# EAGLE design AutomatonXL320 (EAGLE 9.6.2)
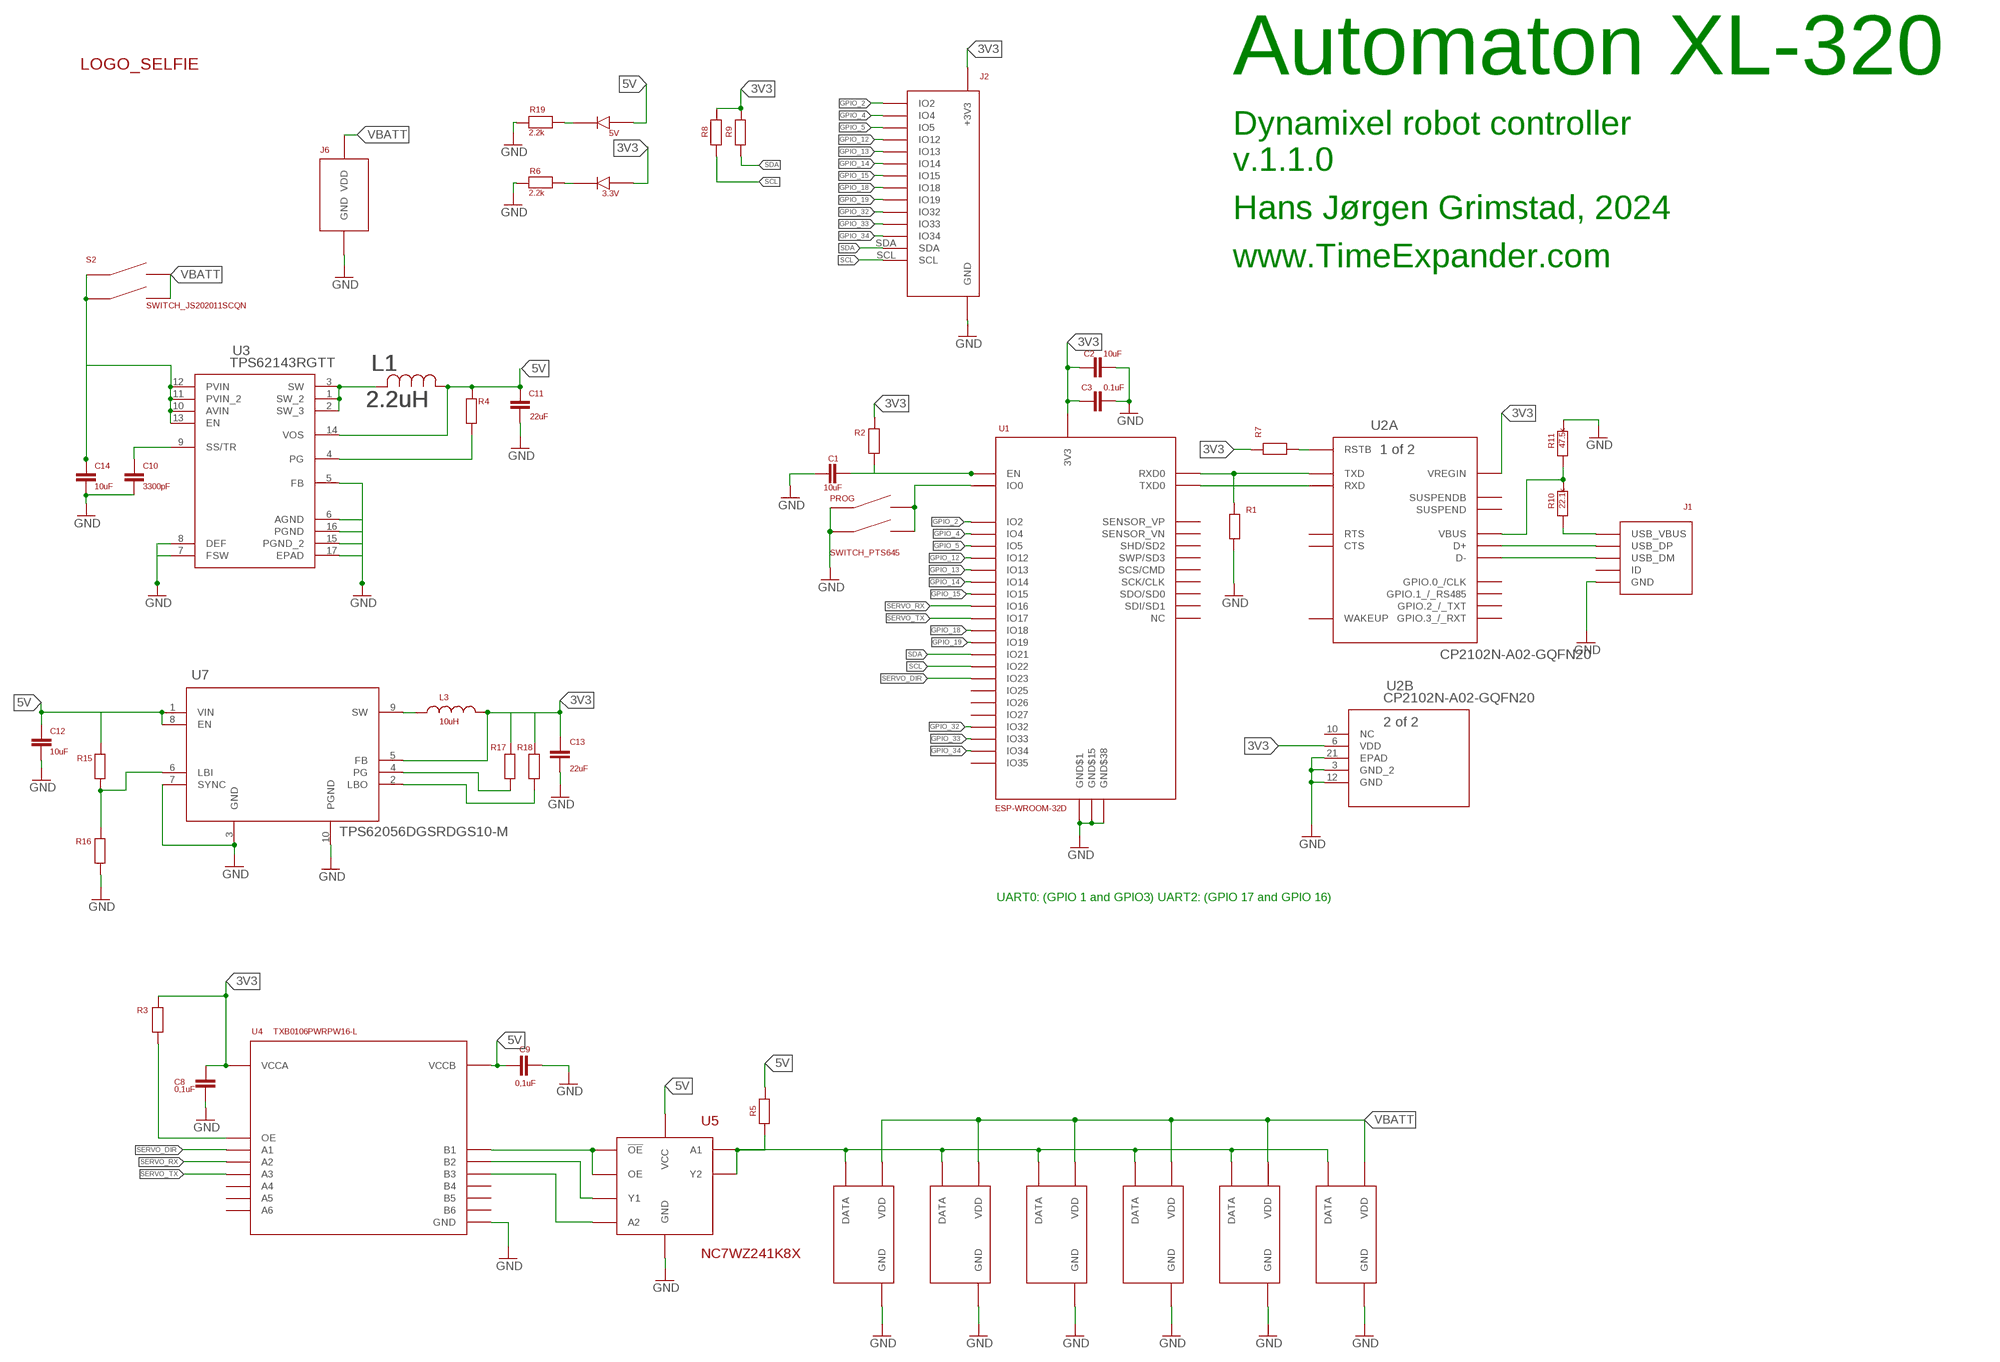
[diagram p0: schematic, sheet 1]

## Parts
3.3V  LED_APTR3216PBC/A  [LED_APTR3216PBC/A]
5V  LED_APTR3216PBC/A  [LED_APTR3216PBC/A]
C1  10uF  CAPACITOR0402  [CAP_0402]
C2  10uF  CAPACITOR0402  [CAP_0402]
C3  0.1uF  CAPACITOR0402  [CAP_0402]
C8  0,1uF  CAPACITOR0402  [CAP_0402]
C9  0,1uF  CAPACITOR0402  [CAP_0402]
C10  3300pF  CAPACITOR0402  [CAP_0402]
C11  22uF  CAPACITOR1206  [CAP_1206]
C12  10uF  CAPACITOR1206  [CAP_1206]
C13  22uF  CAPACITOR1206  [CAP_1206]
C14  10uF  CAPACITOR1206  [CAP_1206]
J1  USB_RCPT_10118192-0001LF  [USB_RCPT_10118192-0001LF]
J2  ESP_ROBOT_BOARD_GPIO_16  [ESP_ROBOT_BOARD_GPIO_16]
J6  BATTERY  POWER_SOLDER_TERMINAL9V  [BATTERY_SOLDER_TERMINAL]
L1  2.2uH  IHLP1616ABER2R2M11IND_IHLP-1616AB-M  [IND_IHLP-1616AB-M]
L3  10uH  INDUCTOR_VLCF4024T-100MR90-2  [IND_4028]
PROG  SWITCH_PTS645  [SWITCH_PTS645_EE_NBIOT_01]
R1  RESISTOR0402  [RES_0402]
R2  RESISTOR0402  [RES_0402]
R3  RESISTOR0402  [RES_0402]
R4  RESISTOR0402  [RES_0402]
R5  RESISTOR0402  [RES_0402]
R6  2.2k  RESISTOR  [RES_0402]
R7  RESISTOR0402  [RES_0402]
R8  RESISTOR0402  [RES_0402]
R9  RESISTOR0402  [RES_0402]
R10  22.1k  RESISTOR0402  [RES_0402]
R11  47.5k  RESISTOR0402  [RES_0402]
R15  RESISTOR0402  [RES_0402]
R16  RESISTOR0402  [RES_0402]
R17  RESISTOR0402  [RES_0402]
R18  RESISTOR0402  [RES_0402]
R19  2.2k  RESISTOR  [RES_0402]
S2  SWITCH_JS202011SCQN  [SWITCH_JS202011SCQN]
U1  ESP-WROOM-32D  [ESP_WROOM_32D]
U2  CP2102N-A02-GQFN20  [QFN20_CP2102N_SIL]
U3  TPS62143RGTT  [RGT16_1P7X1P7]
U4  TXB0106PWRPW16-L  [PW16-L]
U5  NC7WZ241K8X  [NC7WZ241K8X]
U7  TPS62056DGSRDGS10-M  [DGS10-M]
U$1  DYNAMIXEL_MOLEX_MINISPOX_3P_HEADERXL-320  [DYNAMIXEL_MICROLATCH_3P_HEADER]
U$2  LOGO_SELFIESELFIE_2  [TIMEEXPANDER_LOGO_1]
U$4  DYNAMIXEL_MOLEX_MINISPOX_3P_HEADERXL-320  [DYNAMIXEL_MICROLATCH_3P_HEADER]
U$5  DYNAMIXEL_MOLEX_MINISPOX_3P_HEADERXL-320  [DYNAMIXEL_MICROLATCH_3P_HEADER]
U$6  DYNAMIXEL_MOLEX_MINISPOX_3P_HEADERXL-320  [DYNAMIXEL_MICROLATCH_3P_HEADER]
U$8  DYNAMIXEL_MOLEX_MINISPOX_3P_HEADERXL-320  [DYNAMIXEL_MICROLATCH_3P_HEADER]
U$9  DYNAMIXEL_MOLEX_MINISPOX_3P_HEADERXL-320  [DYNAMIXEL_MICROLATCH_3P_HEADER]

## Nets
3V3: 3.3V.A C2.P$1 C3.P$1 C8.P$2 C13.P$1 J2.+3V3 L3.2 R2.P$2 R3.P$2 R7.P$1 R8.P$2 R9.P$2 R17.P$2 R18.P$2 U1.2(3V3) U2.6(B:VDD) U2.7(A:VREGIN) U4.2(VCCA) U7.5(FB)
5V: 5V.A C9.P$1 C11.P$1 C12.P$1 L1.1 R4.P$2 R5.P$2 R15.P$2 U3.14(VOS) U4.15(VCCB) U5.VCC U7.1(VIN) U7.8(EN)
GND: C1.P$1 C2.P$2 C3.P$2 C8.P$1 C9.P$2 C10.P$2 C11.P$2 C12.P$2 C13.P$2 C14.P$2 J1.GND J2.GND J6.-(GND) PROG.A1 PROG.A2 R1.P$2 R6.P$1 R11.P$2 R16.P$1 R19.P$1 U1.1(GND$1) U1.15(GND$15) U1.38(GND$38) U1.GND$39(GND$38) U1.GND$40(GND$38) U1.GND$41(GND$38) U1.GND$42(GND$38) U1.GND$43(GND$38) U1.GND$44(GND$38) U1.GND$45(GND$38) U1.GND$46(GND$38) U1.GND$47(GND$38) U2.3(B:GND_2) U2.12(B:GND) U2.21(B:EPAD) U3.5(FB) U3.6(AGND) U3.7(FSW) U3.8(DEF) U3.15(PGND_2) U3.16(PGND) U3.17(EPAD) U4.9(GND) U5.GND U7.3(GND) U7.7(SYNC) U7.10(PGND) U$1.GND U$4.GND U$5.GND U$6.GND U$8.GND U$9.GND
GPIO_2: J2.IO2 U1.24(IO2)
GPIO_4: J2.IO4 U1.26(IO4)
GPIO_5: J2.IO5 U1.29(IO5)
GPIO_12: J2.IO12 U1.14(IO12)
GPIO_13: J2.IO13 U1.16(IO13)
GPIO_14: J2.IO14 U1.13(IO14)
GPIO_15: J2.IO15 U1.23(IO15)
GPIO_18: J2.IO18 U1.30(IO18)
GPIO_19: J2.IO19 U1.31(IO19)
GPIO_32: J2.IO32 U1.8(IO32)
GPIO_33: J2.IO33 U1.9(IO33)
GPIO_34: J2.IO34 U1.6(IO34)
N$1: C1.P$2 R2.P$1 U1.3(EN)
N$2: 3.3V.C R6.P$2
N$3: C10.P$1 U3.9(SS/TR)
N$4: R1.P$1 U1.34(RXD0) U2.18(A:TXD)
N$5: U1.35(TXD0) U2.17(A:RXD)
N$6: PROG.B1 PROG.B2 U1.25(IO0)
N$7: L1.2 U3.1(SW_2) U3.2(SW_3) U3.3(SW)
N$8: U4.16(B1) U5.!OE U5.OE
N$9: R4.P$1 U3.4(PG)
N$10: U4.14(B2) U5.Y1
N$11: U4.13(B3) U5.A2
N$12: R7.P$2 U2.9(A:RSTB)
N$13: C14.P$1 S2.2(A2) S2.5(A1) U3.10(AVIN) U3.11(PVIN_2) U3.12(PVIN) U3.13(EN)
N$14: R3.P$1 U4.8(OE)
N$15: J1.VCC(USB_VBUS) R10.P$1
N$16: J1.D+(USB_DP) U2.4(A:D+)
N$17: J1.D-(USB_DM) U2.5(A:D-)
N$18: R10.P$2 R11.P$1 U2.8(A:VBUS)
N$19: R5.P$1 U5.A1 U5.Y2 U$1.DATA U$4.DATA U$5.DATA U$6.DATA U$8.DATA U$9.DATA
N$23: 5V.C R19.P$2
N$77: R15.P$1 R16.P$2 U7.6(LBI)
N$78: L3.1 U7.9(SW)
N$80: R17.P$1 U7.4(PG)
N$81: R18.P$1 U7.2(LBO)
SCL: J2.SCL R8.P$1 U1.36(IO22)
SDA: J2.SDA R9.P$1 U1.33(IO21)
SERVO_DIR: U1.37(IO23) U4.1(A1)
SERVO_RX: U1.27(IO16) U4.3(A2)
SERVO_TX: U1.28(IO17) U4.4(A3)
VBATT: J6.+(VDD) S2.3(B2) S2.6(B1) U$1.VDD U$4.VDD U$5.VDD U$6.VDD U$8.VDD U$9.VDD
Unconnected: J1.ID U1.4(SENSOR_VP) U1.5(SENSOR_VN) U1.7(IO35) U1.10(IO25) U1.11(IO26) U1.12(IO27) U1.17(SHD/SD2) U1.18(SWP/SD3) U1.19(SCS/CMD) U1.20(SCK/CLK) U1.21(SDO/SD0) U1.22(SDI/SD1) U1.32(NC) U2.1(A:GPIO.1_/_RS485) U2.2(A:GPIO.0_/CLK) U2.10(B:NC) U2.11(A:SUSPENDB) U2.13(A:WAKEUP) U2.14(A:SUSPEND) U2.15(A:CTS) U2.16(A:RTS) U2.19(A:GPIO.3_/_RXT) U2.20(A:GPIO.2_/_TXT) U4.5(A4) U4.6(A5) U4.7(A6) U4.10(B6) U4.11(B5) U4.12(B4)

## Notes on the sheet
- Automaton XL-320
- Dynamixel robot controller
- v.1.1.0
- Hans Jørgen Grimstad, 2024
- www.TimeExpander.com
- UART0: (GPIO 1 and GPIO3) UART2: (GPIO 17 and GPIO 16)

## Library data of the parts
3.3V 5V = TimeExpander2:LED_APTR3216PBC/A
C1-C3 C8-C14 = TimeExpander2:CAPACITOR
J1 = TimeExpander2:USB_RCPT_10118192-0001LF
J2 = TimeExpander2:ESP_ROBOT_BOARD_GPIO_16
J6 = TimeExpander2:POWER_SOLDER_TERMINAL
L1 = TimeExpander2:IHLP1616ABER2R2M11; BUILT_BY: EMA_UL_Team; MANUFACTURER_PART_NUMBER: IHLP1616ABER2R2M11; VENDOR: VISHAY
L3 = TimeExpander2:INDUCTOR_VLCF4024T-100MR90-2
PROG = TimeExpander2:SWITCH_PTS645
R1-R11 R15-R19 = TimeExpander2:RESISTOR
S2 = TimeExpander2:SWITCH_JS202011SCQN
U1 = TimeExpander2:ESP-WROOM-32D
U2 = TimeExpander2:CP2102N-A02-GQFN20; COPYRIGHT: Copyright (C) 2023 Ultra Librarian. All rights reserved.; MANUFACTURER_PART_NUMBER: CP2102N-A02-GQFN20; MFR_NAME: Silicon Labs
U3 = TimeExpander2:TPS62143RGTT; BUILT_BY: EMA_UL_Team; MANUFACTURER: Texas Instruments; MANUFACTURER_PART_NUMBER: TPS62143RGTT; VENDOR: Texas Instruments
U4 = TimeExpander2:TXB0106PWR; MANUFACTURER_PART_NUMBER: TXB0106PWR; VENDOR: Texas Instruments
U5 = TimeExpander2:NC7WZ241K8X
U7 = TimeExpander2:TPS62056DGSR; BUILT_BY: EMA_UL_Team; MANUFACTURER: Texas Instruments; MANUFACTURER_PART_NUMBER: TPS62056DGSR; VENDOR: Texas Instruments
U$1 U$4-U$6 U$8 U$9 = TimeExpander2:DYNAMIXEL_MOLEX_MINISPOX_3P_HEADER
U$2 = TimeExpander2:LOGO_SELFIE

## Board
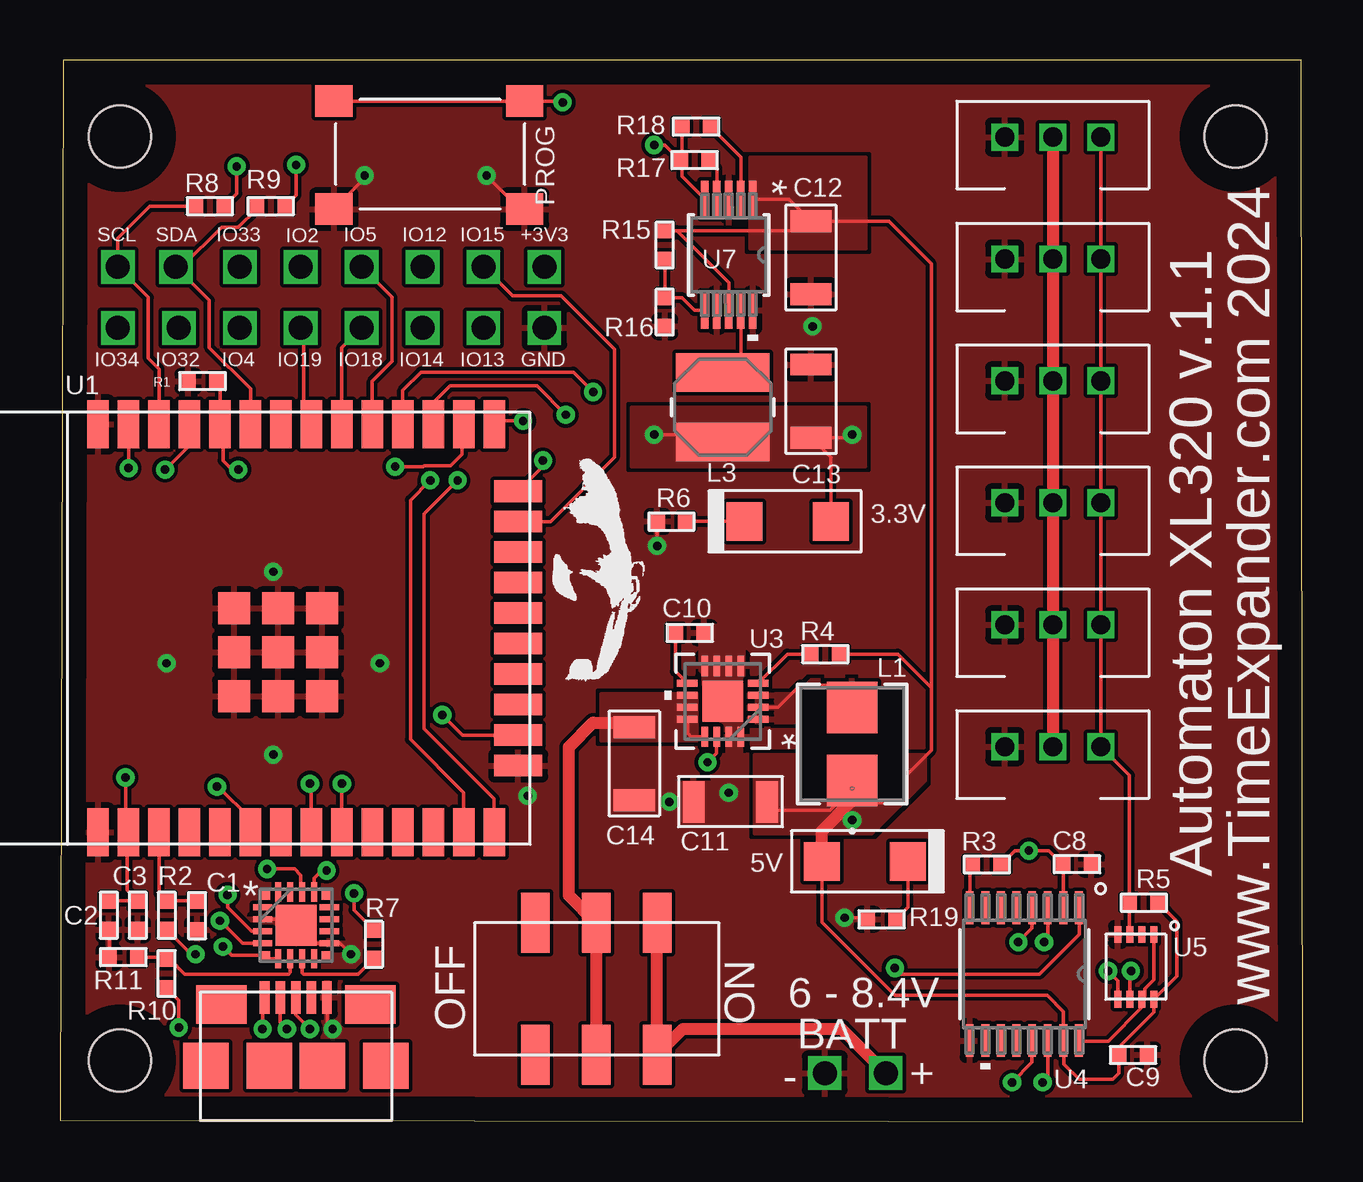
[diagram p1: board, top side]
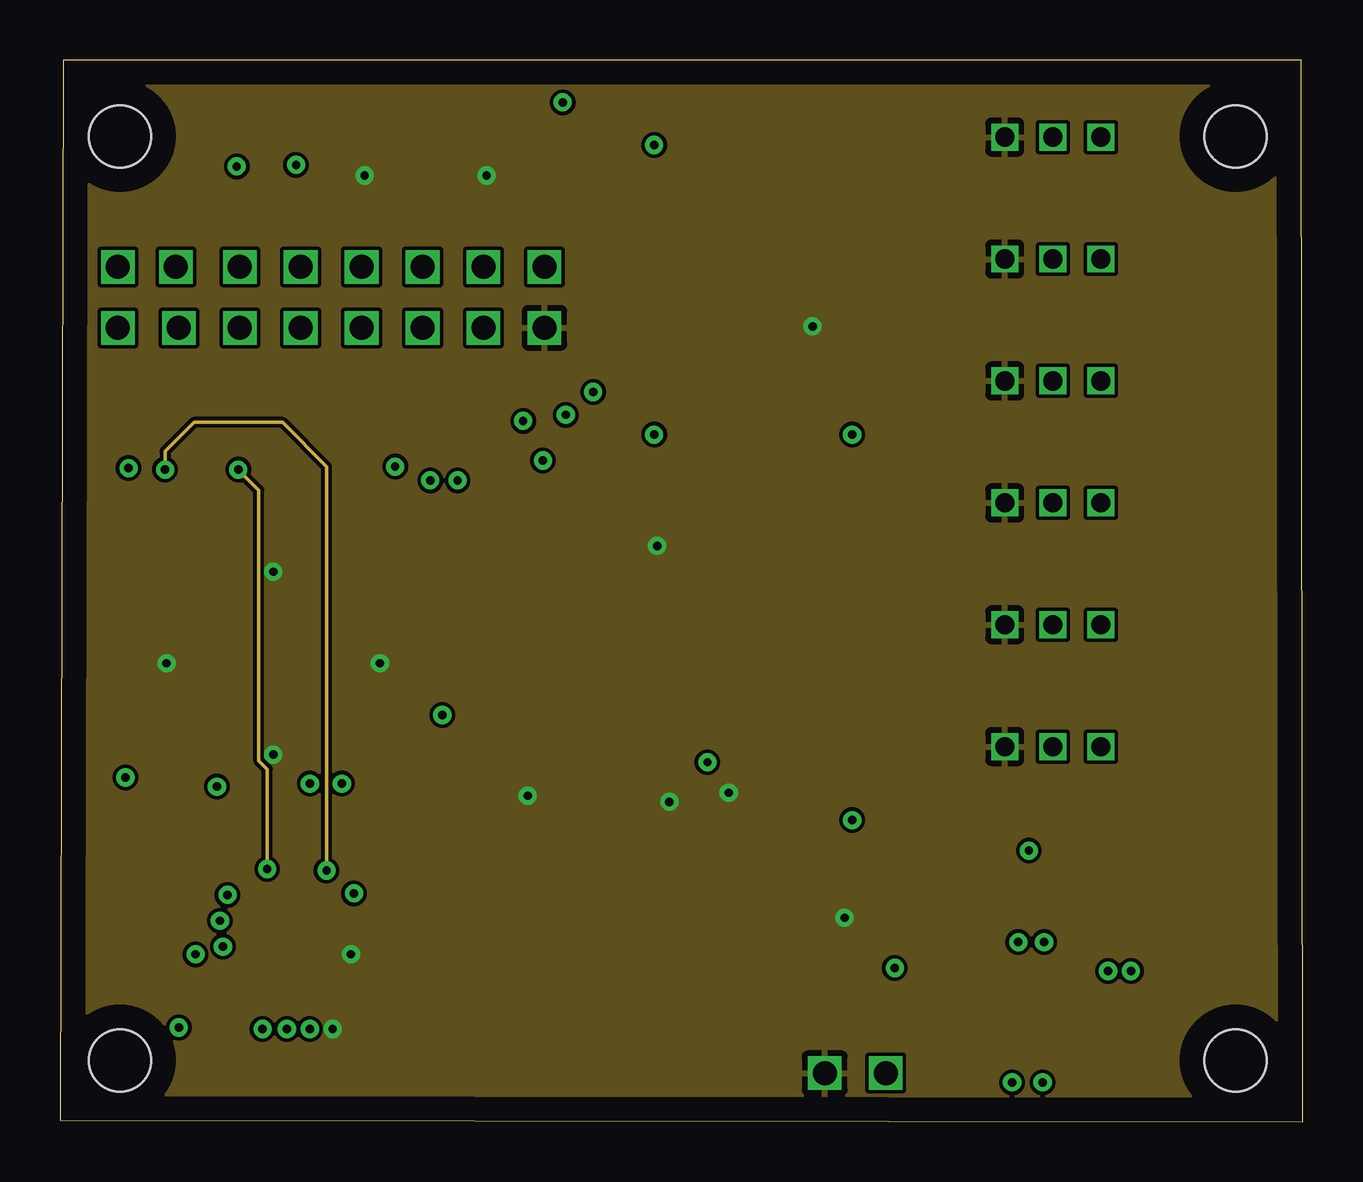
[diagram p2: board, inner layer GND]
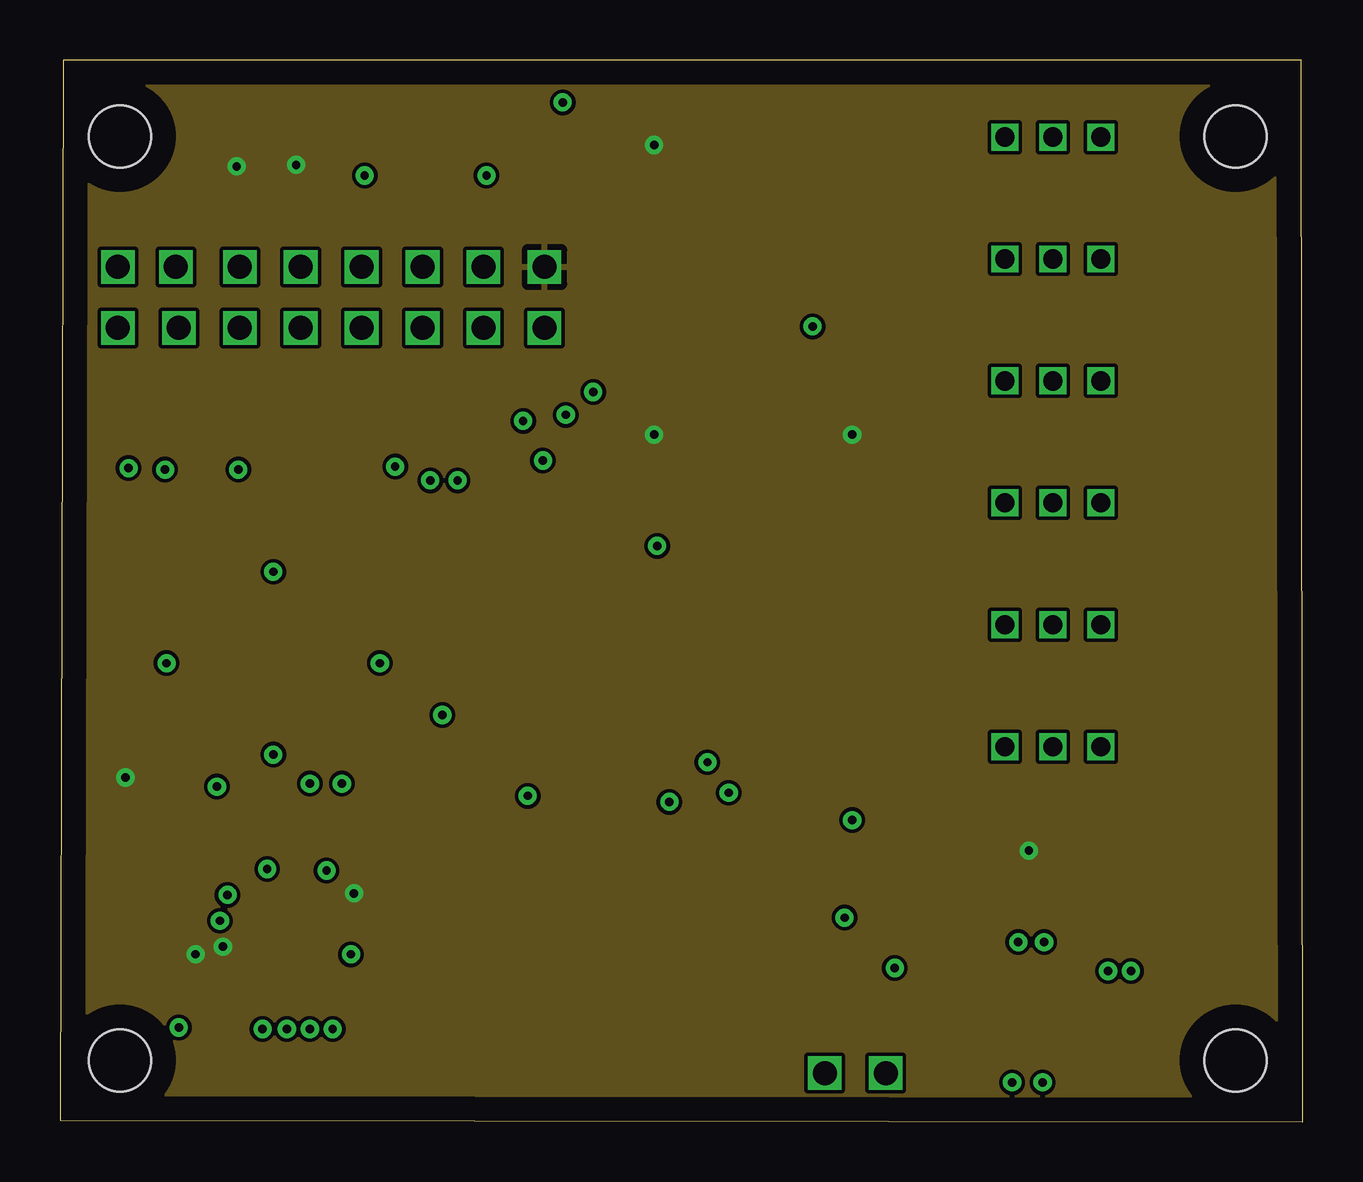
[diagram p3: board, inner layer 3V3]
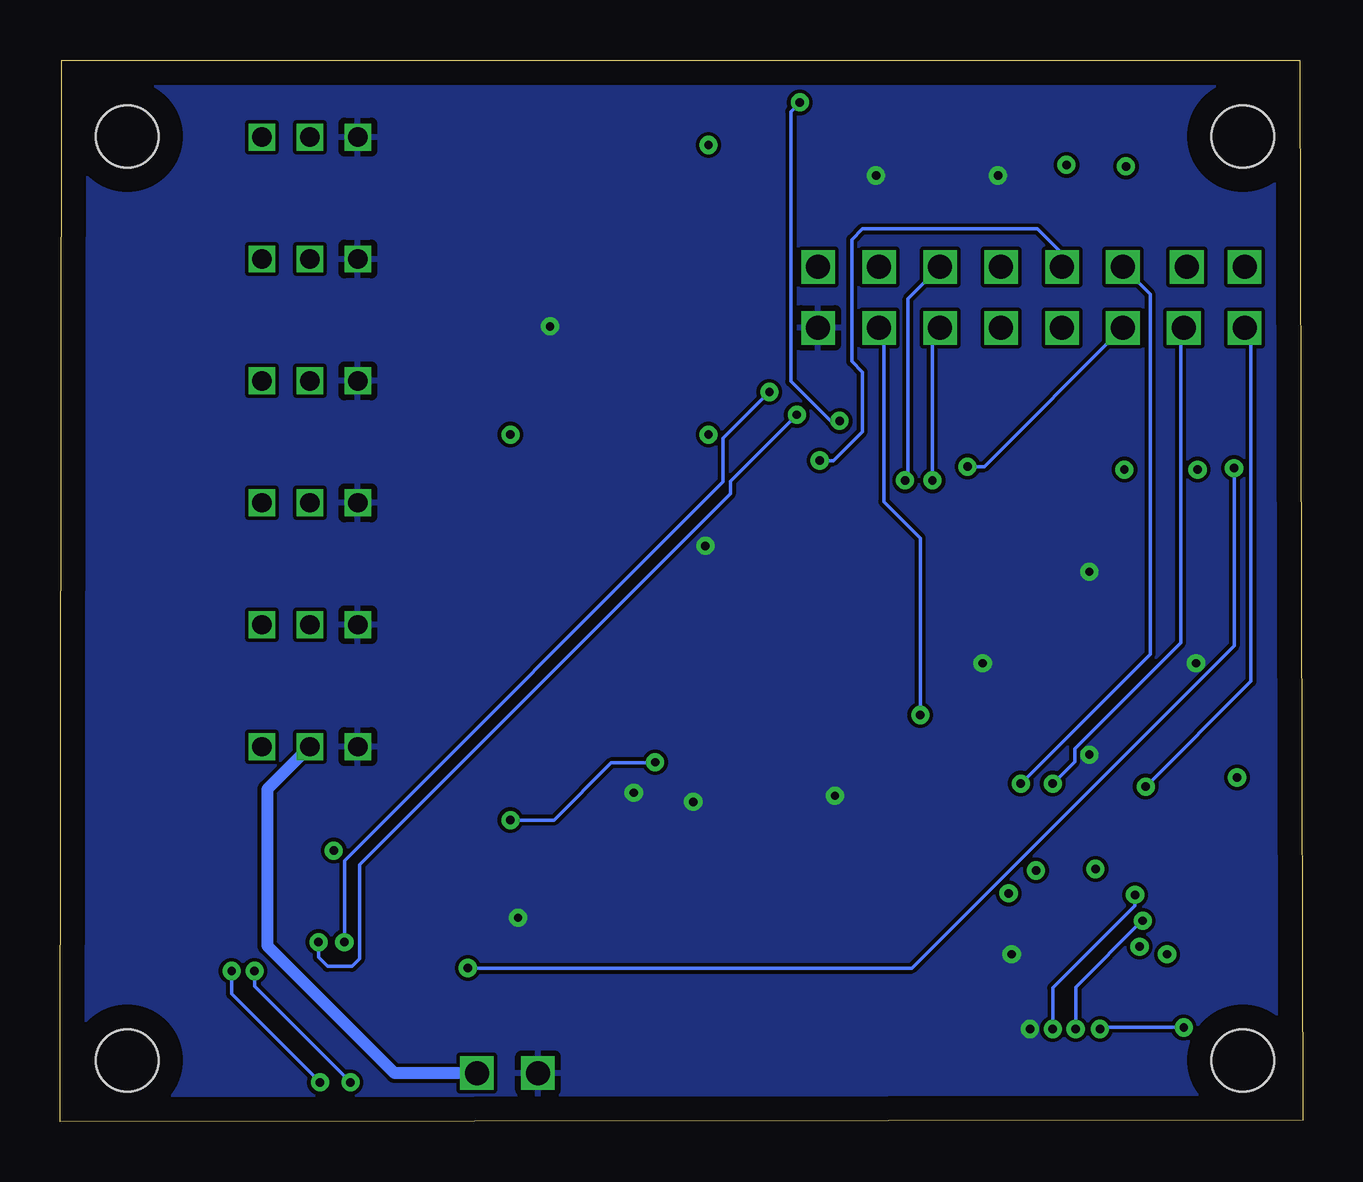
[diagram p4: board, bottom side, seen from below]

Size 51.8 x 44.25 mm. Coordinates in mm from the lower left corner, seen from the top.
Outline: 0,0.06 51.8,0 51.73,44.25 0.13,44.25 0,0.06
Copper layers (1+2*15+16): Top 0.035mm / dielectric 1.5mm / GND 0.035mm / dielectric 0.15mm / 3V3 0.035mm / dielectric 0.2mm / Bottom 0.035mm
Design rules "default *": minimum track width 6mil, minimum drill 0.35mm, track to track 6mil, track to pad 6mil, pad to pad 6mil, via to via 6mil, smd to smd 6mil, copper to edge 40mil, drill to drill 6mil, minimum pad ring 5mil, minimum via ring 8mil, stop-mask expansion 4mil, vias tented up to drill 14mil, thermal gap 10mil
Holes 2.6 mm at 2.5,41.06 49,2.56 2.5,2.56 49,41.06

### Footprints (pad centres in the part's own frame; a part is rotated, then mirrored left to right if it is on the bottom)
LED_APTR3216PBC/A = smd 1.5 x 1.6: A 0,0; C 3.6,0
CAP_0402 = smd 0.635 x 0.61: P$1 0,0; P$2 1.194,0
CAP_1206 = smd 0.914 x 1.72: P$1 0,0; P$2 3.048,0
USB_RCPT_10118192-0001LF = smd 0.4 x 1.35: D+ 3.1,0.3; D- 2.45,0.3; GND 4.4,0.3; ID 3.75,0.3; VCC 1.8,0.3 | smd 2.1 x 1.6: P$1 0,0; P$2 6.2,0 | smd 1.9 x 1.9: P$8 -0.65,-2.55; P$9 6.85,-2.55; P$10 2,-2.55; P$11 4.2,-2.55
ESP_ROBOT_BOARD_GPIO_16 = drill 1 square: +3V3 2.54,-15.24; GND 0,-15.24; IO2 2.54,-5.08; IO4 0,-2.54; IO5 2.54,-7.62; IO12 2.54,-10.16; IO13 0,-12.7; IO14 0,-10.16; IO15 2.54,-12.7; IO18 0,-7.62; IO19 0,-5.08; IO32 0,0; IO33 2.54,-2.54; IO34 0,2.54; SCL 2.54,2.54; SDA 2.54,0.127
BATTERY_SOLDER_TERMINAL = drill 1 square: + 0,0; - 2.54,0
IND_IHLP-1616AB-M = smd 2.142 x 2.103: 1 -1.528,0; 2 1.528,0
IND_4028 = smd 1.6 x 3.9: 1 -1.45,0; 2 1.45,0
SWITCH_PTS645_EE_NBIOT_01 = smd 1.55 x 1.3: A1 0,0; A2 7.95,0; B1 0,-4.5; B2 7.95,-4.5
RES_0402 = smd 0.635 x 0.61: P$1 0,0; P$2 1.194,0
SWITCH_JS202011SCQN = smd 2.5 x 1.2: 1 0,0; 2 0,-2.54; 3 0,-5.08; 4 5.5,0; 5 5.5,-2.54; 6 5.5,-5.08
ESP_WROOM_32D = smd 2 x 0.9: 1 0,16.51; 2 0,15.24; 3 0,13.97; 4 0,12.7; 5 0,11.43; 6 0,10.16; 7 0,8.89; 8 0,7.62; 9 0,6.35; 10 0,5.08; 11 0,3.81; 12 0,2.54; 13 0,1.27; 14 0,0; 25 17,0; 26 17,1.27; 27 17,2.54; 28 17,3.81; 29 17,5.08; 30 17,6.35; 31 17,7.62; 32 17,8.89; 33 17,10.16; 34 17,11.43; 35 17,12.7; 36 17,13.97; 37 17,15.24; 38 17,16.51 | smd 0.9 x 2: 15 2.785,-1; 16 4.055,-1; 17 5.325,-1; 18 6.595,-1; 19 7.865,-1; 20 9.135,-1; 21 10.405,-1; 22 11.675,-1; 23 12.945,-1; 24 14.215,-1 | smd 1.33 x 1.33: GND$39 5.665,10.845; GND$40 7.5,10.845; GND$41 9.335,10.845; GND$42 5.665,9.01; GND$43 7.5,9.01; GND$44 9.335,9.01; GND$45 5.665,7.175; GND$46 7.5,7.175; GND$47 9.335,7.175
QFN20_CP2102N_SIL = smd 0.356 x 0.356: 1 -1.25,1.25; 6 -1.25,-1.25; 11 1.25,-1.25; 16 1.25,1.25 | smd 0.808 x 0.255: 2 -1.395,0.75; 3 -1.395,0.25; 4 -1.395,-0.25; 5 -1.395,-0.75; 12 1.395,-0.75; 13 1.395,-0.25; 14 1.395,0.25; 15 1.395,0.75 | smd 0.255 x 0.808: 7 -0.75,-1.395; 8 -0.25,-1.395; 9 0.25,-1.395; 10 0.75,-1.395; 17 0.75,1.395; 18 0.25,1.395; 19 -0.25,1.395; 20 -0.75,1.395 | smd 1.702 x 1.702: 21 0,0
RGT16_1P7X1P7 = smd 0.85 x 0.28: 1 -1.475,0.75; 2 -1.475,0.25; 3 -1.475,-0.25; 4 -1.475,-0.75; 9 1.475,-0.75; 10 1.475,-0.25; 11 1.475,0.25; 12 1.475,0.75 | smd 0.28 x 0.85: 5 -0.75,-1.475; 6 -0.25,-1.475; 7 0.25,-1.475; 8 0.75,-1.475; 13 0.75,1.475; 14 0.25,1.475; 15 -0.25,1.475; 16 -0.75,1.475 | smd 1.7 x 1.7: 17 0,0
PW16-L = smd 1.365 x 0.325: 1 -2.769,2.275; 2 -2.769,1.625; 3 -2.769,0.975; 4 -2.769,0.325; 5 -2.769,-0.325; 6 -2.769,-0.975; 7 -2.769,-1.625; 8 -2.769,-2.275; 9 2.769,-2.275; 10 2.769,-1.625; 11 2.769,-0.975; 12 2.769,-0.325; 13 2.769,0.325; 14 2.769,0.975; 15 2.769,1.625; 16 2.769,2.275
NC7WZ241K8X = smd 0.7 x 0.3: !OE 0,0; A1 0,-0.5; A2 2.7,-1.5; GND 0,-1.5; OE 2.7,-0.5; VCC 2.7,0; Y1 2.7,-1; Y2 0,-1
DGS10-M = smd 1.528 x 0.299: 1 -2.313,1; 2 -2.313,0.5; 3 -2.313,0; 4 -2.313,-0.5; 5 -2.313,-1; 6 2.313,-1; 7 2.313,-0.5; 8 2.313,0; 9 2.313,0.5; 10 2.313,1
DYNAMIXEL_MICROLATCH_3P_HEADER = drill 0.8 square: DATA 4,0; GND 0,0; VDD 2,0

### Placement (x,y rotation side)
3.3V  32.13,25.02 180 top
5V  31.75,10.86 0 top
C1  5.71,8 90 top
C2  2.03,9.21 270 top
C3  3.24,9.21 270 top
C8  42.99,10.73 180 top
C9  44.13,2.79 0 top
C10  25.65,20.38 0 top
C11  29.46,13.33 180 top
C12  31.31,37.53 270 top
C13  31.31,28.51 90 top
C14  23.94,16.45 270 top
J1  6.73,4.89 0 top
J2  4.95,33.08 90 top
J6  34.42,2.03 180 top
L1  33.02,15.75 90 top
L3  27.62,29.78 270 top
PROG  19.37,38.04 180 top
R1  6.54,30.86 180 top
R2  4.45,9.21 270 top
R3  38.04,10.73 0 top
R4  31.31,19.49 0 top
R5  44.58,9.14 0 top
R6  24.89,25.02 0 top
R7  13.08,8 270 top
R8  5.65,38.16 0 top
R9  8.19,38.16 0 top
R10  4.45,5.59 90 top
R11  3.24,6.86 180 top
R15  25.21,35.94 90 top
R16  25.21,33.15 90 top
R17  27.05,40.07 180 top
R18  27.11,41.47 180 top
R19  33.66,8.45 0 top
S2  19.81,2.79 90 top
U1  18.1,12.06 90 top
U2  9.84,8.19 0 top
U3  27.62,17.53 180 top
U4  40.2,6.16 270 top
U5  45.59,7.81 270 top
U7  27.88,36.13 270 top
U$1  39.38,15.63 0 top
U$2  18.67,18.22 0 top
U$4  39.38,20.71 0 top
U$5  39.38,25.8 0 top
U$6  39.38,30.88 0 top
U$8  39.38,35.95 0 top
U$9  39.38,41.03 0 top

### Tracks (layer width: path | path; a pad name or v marks a point on that pad's centre or on a via)
3V3  (via drill 0.35)
  Top 0.152: C2.P$1 C3.P$1 2.79,9.65 2.79,11.49 | U1.2 2.86,11.43 2.79,11.49 | v2.73,14.35 2.73,11.56 2.79,11.49 | v5.65,6.98 5.47,6.98 R2.P$2 | R8.P$2 7.37,38.68 v7.37,39.81 | R9.P$2 9.84,38.62 v9.84,39.88 | R7.P$1 12.26,8.83 v12.26,9.52 | U2.7 8.74,6.8 U2.6 7.16,6.94 v6.79,7.3 | R3.P$2 39.8,11.3 v40.39,11.3 41.22,11.3 C8.P$2 41.82,10.71 U4.2 | R18.P$2 25.92,40.13 | 25.92,40.13 R17.P$2 25.22,40.7 v24.77,40.7 | U7.5 25.92,39.4 25.92,40.13 | 3.3V.A 32.13,27.69 C13.P$1 32.89,28.51 v33.02,28.64 | v24.77,28.64 27.32,28.64 L3.2
  pour 3V3: 0,0.06 0,43.62 51.56,43.62 51.56,0.06
  pour Top (no thermals): 33.57,29.78 23.81,29.78 23.81,27.3 33.57,27.3
5V  (via drill 0.35)
  Top 0.152: C11.P$1 29.82,12.98 32.1,12.98 32.61,13.49 32.61,13.81 | R5.P$2 46.55,8.37 46.55,6.06 U5.VCC 45.59,4.57 44.13,3.11 C9.P$1 44.13,2.03 43.88,1.78 42.48,1.78 41.85,2.41 41.85,3.36 U4.15 41.82,4.6 41.15,5.27 34.8,5.27 31.75,8.32 5V.A | U7.1 30.39,38.44 C12.P$1 | L1.1 33.13,14.22 34.05,13.3 35.19,13.3 35.28,13.39 35.28,14.45 36.32,15.49 36.32,18.1 | 36.32,18.1 36.32,35.75 34.54,37.53 C12.P$1 | R15.P$2 25.72,37.14 | 25.72,37.14 30.91,37.14 C12.P$1 | U7.8 27.88,34.98 25.72,37.14 | R4.P$2 34.92,19.49 36.32,18.1 | U3.14 27.37,15.37 v26.99,14.99
  Top 0.5: 5V.A 31.75,12.12 33.02,13.39 L1.1 32.61,13.81
  Bottom 0.152: v26.99,14.99 27.02,14.96 28.83,14.96 31.21,12.57 v33.02,12.57
  pour Top (no thermals): 28.96,15.3 28.96,12 33.85,12 36.07,14.22 36.07,15.3
  pour Top (no thermals): 33.59,40.2 28.77,40.2 28.77,36.39 33.59,36.39
GND  (via drill 0.35)
  Top 0.152: PROG.A2 12.7,39.32 v12.7,39.43 | PROG.A1 19.18,38.04 v17.78,39.43 | J1.GND 11.13,4.11 v11.37,3.87 | U2.3 9.27,8.44 9.27,8.45 9.59,8.45 U2.21 10.59,7.44 U2.12 11.67,7.44 v12.13,6.98 | v32.7,8.51 33.59,8.51 R19.P$1 | R6.P$1 v24.89,24 | C2.P$2 2.04,8 R11.P$2
  other vias: 4.45,19.11 8.89,22.92 13.34,19.11 8.89,15.3 19.49,13.59 25.4,13.33 27.88,13.72 31.37,33.15
  pour Bottom: 0,0.06 0,43.62 51.63,43.62 51.63,0.06
  pour GND: 0,0.06 0,43.62 51.63,43.62 51.63,0.06
  pour Top: 33.59,35.5 28.77,35.5 28.77,32.58 30.04,32.58 30.04,30.73 33.59,30.73
  pour Top (rank 3): 0,0.06 0,43.62 51.75,43.62 51.75,0.06
  pour Top (no thermals): 22.54,14.16 27.24,14.16 27.81,14.73 27.81,16.7 27.75,16.76 26.86,16.76 26.86,18.61 26.67,18.8 26.67,20.7 28.51,20.7 28.51,18.61 28.38,18.48 28.38,13.02 27.56,12.19 22.54,12.19
GPIO_2  (via drill 0.35)
  Top 0.152: U1.24 20.13,27.31 v20.13,27.56
  Bottom 0.152: v20.13,27.56 19.56,27.56 18.35,28.77 18.35,31.24 18.8,31.69 18.8,36.77 18.35,37.21 11.05,37.21 10.03,36.2 J2.IO2
GPIO_4  (via drill 0.35)
  Top 0.152: U1.26 16.76,29 16.76,27.81 16.29,27.34 15.18,27.34 15.14,27.3 v13.97,27.3
  Bottom 0.152: v13.97,27.3 13.27,27.3 J2.IO4
GPIO_5
  Top 0.152: U1.29 13.02,30.86 13.84,31.69 13.84,34.35 J2.IO5
GPIO_12  (via drill 0.35)
  Top 0.152: U1.14 18.1,13.46 15.18,16.38 15.18,25.34 v16.57,26.73
  Bottom 0.152: v16.57,26.73 16.45,26.86 16.45,34.29 J2.IO12
GPIO_13  (via drill 0.35)
  Top 0.152: U1.16 16.77,16.12 v15.94,16.95
  Bottom 0.152: v15.94,16.95 15.94,24.32 17.46,25.84 17.46,32.89 J2.IO13
GPIO_14  (via drill 0.35)
  Top 0.152: U1.13 16.83,13.72 14.61,15.94 14.61,25.91 v15.43,26.73
  Bottom 0.152: v15.43,26.73 15.43,32.77 J2.IO14
GPIO_15
  Top 0.152: J2.IO15 18.86,34.42 20.89,34.42 23.11,32.19 23.11,27.69 20.44,25.01 U1.23
GPIO_18
  Top 0.152: U1.30 11.75,32.26 J2.IO18
GPIO_19
  Top 0.152: U1.31 10.16,29.38 10.16,32.96 J2.IO19
GPIO_32  (via drill 0.35)
  Top 0.152: U1.8 10.48,14.03 v10.41,14.1
  Bottom 0.152: v10.41,14.1 9.5,15.01 9.5,15.55 5.08,19.97 5.08,32.96 J2.IO32
GPIO_33  (via drill 0.35)
  Top 0.152: U1.9 v11.75,14.1
  Bottom 0.152: v11.75,14.1 6.35,19.49 6.35,34.48 J2.IO33
GPIO_34  (via drill 0.35)
  Top 0.152: U1.6 7.94,12.64 6.6,13.97 v6.54,13.97
  Bottom 0.152: v6.54,13.97 2.16,18.35 2.16,32.83 J2.IO34
N$1
  Top 0.152: U1.3 4.13,9.52 R2.P$1 5.7,9.21 C1.P$2
N$2
  Top 0.152: R6.P$2 3.3V.C
N$3
  Top 0.152: C10.P$1 25.65,18.77 U3.9
N$4  (via drill 0.35)
  Top 0.152: R1.P$1 6.67,30.73 U1.34 6.79,28.94 6.79,27.56 7.18,27.18 v7.43,27.18 | U2.18 10.03,9.65 10.03,10.29 9.78,10.54 v8.64,10.54
  GND 0.152: v8.64,10.54 8.64,14.7 8.28,15.05 8.28,26.32 v7.43,27.18
N$5  (via drill 0.35)
  Top 0.152: U2.17 10.59,10.15 10.92,10.48 v11.11,10.48 | U1.35 5.4,28.19 v4.38,27.18
  GND 0.152: v11.11,10.48 11.11,27.3 9.27,29.15 5.59,29.15 4.38,27.94 v4.38,27.18
N$6  (via drill 0.35)
  Top 0.152: U1.25 18.24,29.21 v19.3,29.21 | v20.95,42.48 20.9,42.54 PROG.B1 PROG.B2
  Bottom 0.152: v20.95,42.48 21.34,42.1 21.34,30.86 19.68,29.21 v19.3,29.21
N$7
  Top 0.152: U3.2 29.93,17.28 30.85,18.2 31.99,18.2 32.91,17.28 L1.2
  pour Top: 28.7,17.84 28.7,16.64 30.86,16.64 31.37,16.13 34.16,16.13 34.16,18.42 31.31,18.42 30.73,17.84
N$8
  Top 0.152: U4.16 42.49,3.37 43.69,3.37 45.09,4.77 U5.OE 45.21,5.23 45.21,5.56 45.59,5.93 U5.!OE
N$9
  Top 0.152: U3.4 30.32,19.49 R4.P$1
N$10  (via drill 0.35)
  Top 0.152: U5.Y1 44.59,6.24 v44.64,6.29 | U4.14 41.17,1.86 v40.96,1.65
  Bottom 0.152: v40.96,1.65 44.64,5.33 v44.64,6.29
N$11  (via drill 0.35)
  Top 0.152: U5.A2 44.09,5.88 v43.69,6.29 | U4.13 40.52,2.48 v39.69,1.65
  Bottom 0.152: v39.69,1.65 43.69,5.65 v43.69,6.29
N$12
  Top 0.152: U2.9 10.1,6.22 10.16,6.16 12.43,6.16 R7.P$2
N$13
  Top 0.152: 23.75,16.64 C14.P$1 | U3.13 26.3,16.05 26.15,16.21 U3.12
  Top 0.5: S2.2 S2.5 21.21,9.44 21.21,15.62 22.23,16.64 23.75,16.64
  pour Top (no thermals): 22.54,15.88 26.54,15.88 26.54,17.84 22.54,17.84
N$14
  Top 0.152: U4.8 37.92,10.62 R3.P$1
N$15  (via drill 0.35)
  Top 0.152: R10.P$1 4.95,5.08 v4.95,3.94 | v8.45,3.87 8.45,5.1 J1.VCC
  Bottom 0.152: v4.95,3.94 8.38,3.94 v8.45,3.87
N$16  (via drill 0.35)
  Top 0.152: J1.D+ 9.83,4.46 v10.41,3.87 | U2.4 8,7.94 6.99,8.95 v6.99,9.46
  Bottom 0.152: v6.99,9.46 6.99,9.02 10.41,5.59 v10.41,3.87
N$17  (via drill 0.35)
  Top 0.152: J1.D- 9.18,4.15 v9.46,3.87 | U2.5 7.61,7.44 v6.67,8.38
  Bottom 0.152: v6.67,8.38 6.7,8.38 9.46,5.62 v9.46,3.87
N$18
  Top 0.152: R11.P$1 4.35,6.86 R10.P$2 4.58,6.78 5.21,6.16 9.53,6.16 9.59,6.23 U2.8
N$19
  Top 0.152: U$9.DATA U$8.DATA U$6.DATA U$5.DATA U$4.DATA U$1.DATA 44.58,14.44 R5.P$1 44.58,7.83 U5.Y2 U5.A1
N$23
  Top 0.152: R19.P$2 35.35,8.95 5V.C
N$77
  Top 0.152: U7.6 26.44,33.82 25.92,34.34 R16.P$2 R15.P$1
N$78
  Top 0.152: U7.9 28.38,31.99 L3.1
N$80
  Top 0.152: U7.4 27.38,39.74 R17.P$1
N$81
  Top 0.152: U7.2 28.38,40.2 R18.P$1
SCL
  Top 0.152: U1.36 4.13,31.37 3.68,31.81 3.68,34.35 J2.SCL 2.41,36.83 3.75,38.16 R8.P$1
SDA
  Top 0.152: U1.33 7.94,30.54 6.22,32.26 6.22,34.23 J2.SDA 5.08,35.62 6.73,37.27 7.43,37.27 8.19,38.04 R9.P$1
SERVO_DIR  (via drill 0.35)
  Top 0.152: v34.8,6.41 35.05,6.16 40.83,6.16 42.48,7.81 42.48,8.92 U4.1 | U1.37 v2.86,27.24
  Bottom 0.152: v2.86,27.24 2.86,19.84 16.29,6.41 v34.8,6.41
SERVO_RX  (via drill 0.35)
  Top 0.152: U1.27 15.56,29.97 16.26,30.67 19.88,30.67 v21.08,29.46 | U4.3 41.17,7.64 v41.02,7.49
  Bottom 0.152: v21.08,29.46 23.85,26.69 23.85,26.17 39.31,10.71 39.31,6.79 39.62,6.48 40.64,6.48 41.02,6.86 v41.02,7.49
SERVO_TX  (via drill 0.35)
  Top 0.152: U1.28 14.29,30.48 15.05,31.24 21.4,31.24 v22.23,30.42 | U4.4 40.52,8.07 v39.94,7.49
  Bottom 0.152: v22.23,30.42 24.16,28.48 24.16,26.67 39.94,10.89 v39.94,7.49
VBATT
  Top 0.5: J6.+ 32.58,3.87 25.97,3.87 S2.3 S2.6 | U$9.VDD U$8.VDD U$6.VDD U$5.VDD U$4.VDD U$1.VDD
  Bottom 0.5: J6.+ 37.85,2.03 43.16,7.34 43.16,13.86 U$1.VDD

### Text on the board
tPlace: Automaton XL320 v.1.1 | 6 - 8.4V | www.TimeExpander.com 2024